# Altium schematic sheet Connectors.SchDoc
size A; SheetNumber: 2; SheetTotal: 3
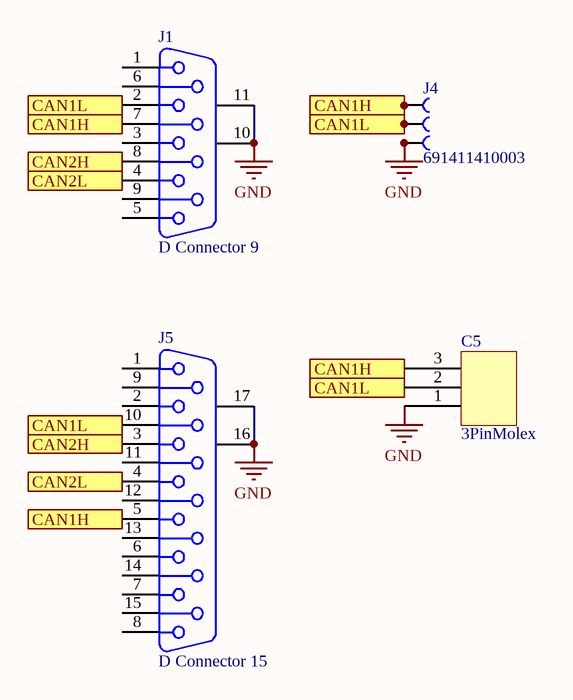
[diagram p0: Connectors.SchDoc]

## Parts
C5  3PinMolex  [3PinMolex]
J1  D Connector 9  [DSUB1.385-2H9]
J4  691411410003  [691411410003]
J5  D Connector 15  [DSUB1.385-2H15]

## Ports
CAN1H, CAN1L, CAN2H, CAN2L

## Nets
GND: C5.1 J1.10(MH1) J1.11(MH2) J4.3 J4.A3 J5.16(MH1) J5.17(MH2)
CAN1H: C5.3 J1.7 J4.1 J4.A1 J5.5 ; port CAN1H
CAN1L: C5.2 J1.2 J4.2 J4.A2 J5.10 ; port CAN1L
CAN2H: J1.8 J5.3 ; port CAN2H
CAN2L: J1.4 J5.4 ; port CAN2L

Not connected (* = marked no-connect by the designer): J1 1 3 5 6 9; J5 1 2 6 7 8 9 11 12 13 14 15

## Library data of the parts
J1 = D Connector 9: Receptacle Assembly, 9 Position, Right Angle; PackageDocument: O; Positions: 9; Published: 15-Jun-2001; LatestRevisionDate: 17-Jul-2002; LatestRevisionNote: Re-released for DXP Platform.; DatasheetDocument: 1-Sep-1999; PackageReference: 788750; Publisher: Altium Limited; Orientation: Right Angle; Gender: Receptacle
J4 = 691411410003: TERM BLK 3P SIDE ENT 7.62MM PCB; MF: Wurth Electronics Inc.; Availability: In Stock; Package: None; Value: *; Price: None; SnapEDA_Link: https://www.snapeda.com/parts/691411410003/Wurth+Electronics+Inc/view-part/?ref=snap; Check_prices: https://www.snapeda.com/parts/691411410003/Wurth+Electronics+Inc/view-part/?ref=eda; Purchase-URL: https://pricing.snapeda.com/search/part/691411410003/?ref=eda; MP: 691411410003
J5 = D Connector 15: Receptacle Assembly, 15 Position, Right Angle; PackageDocument: O; Positions: 15; Published: 15-Jun-2001; LatestRevisionDate: 17-Jul-2002; LatestRevisionNote: Re-released for DXP Platform.; DatasheetDocument: 1-Sep-99; PackageReference: 788757; Publisher: Altium Limited; Orientation: Right Angle; Gender: Receptacle